# EAGLE schematic Encoder (EAGLE 9.5.2)
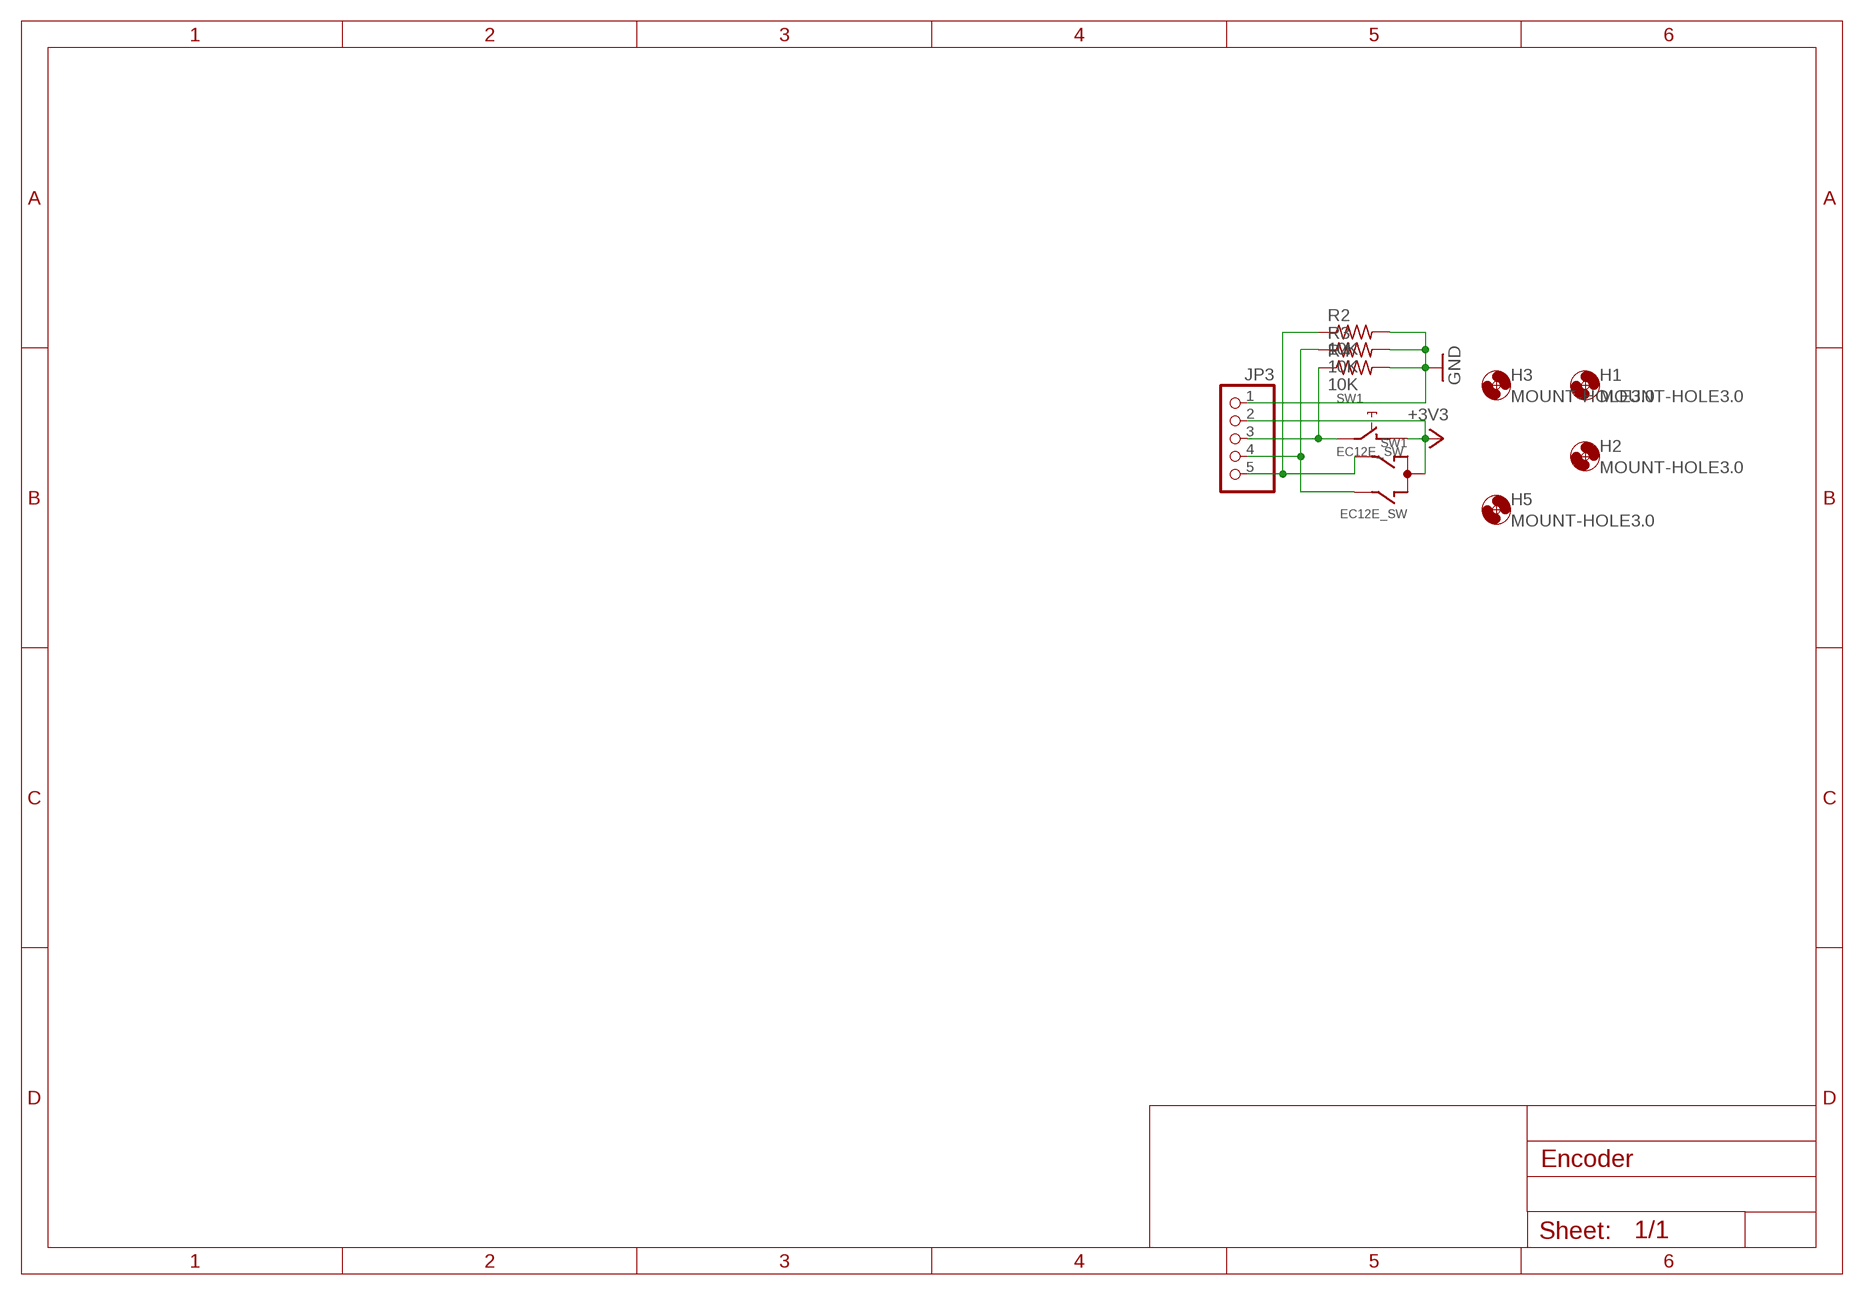
[diagram p0: schematic, sheet 1]

## Parts
H1  MOUNT-HOLE3.0  [3,0]
H2  MOUNT-HOLE3.0  [3,0]
H3  MOUNT-HOLE3.0  [3,0]
H5  MOUNT-HOLE3.0  [3,0]
JP3  PINHD-1X5  [1X05]
R2  10K  R-US_R0805  [R0805]
R3  10K  R-US_R0805  [R0805]
R4  10K  R-US_R0805  [R0805]
SW1  EC12E_SW  [ALPS_EC12E_SW]

## Nets
+3V3: JP3.2 SW1.C SW1.D
GND: JP3.1 R2.2 R3.2 R4.2
N$1: JP3.4 R3.1 SW1.B
N$2: JP3.5 R2.1 SW1.A
N$3: JP3.3 R4.1 SW1.E
Unconnected: SW1.GND1(G) SW1.GND2(G)

## Library data of the parts
H1-H3 H5 = holes:MOUNT-HOLE: MOUNTING HOLE with drill center marker
JP3 = pinhead:PINHD-1X5: PIN HEADER
R2-R4 = rcl:R-US_: RESISTOR, American symbol
SW1 = switch-alps:EC12E_SW: ALPS rotary Encoder EC12E series with switch; MPN: EC12E2424407; OC_FARNELL: 1520813; OC_NEWARK: 74M1068